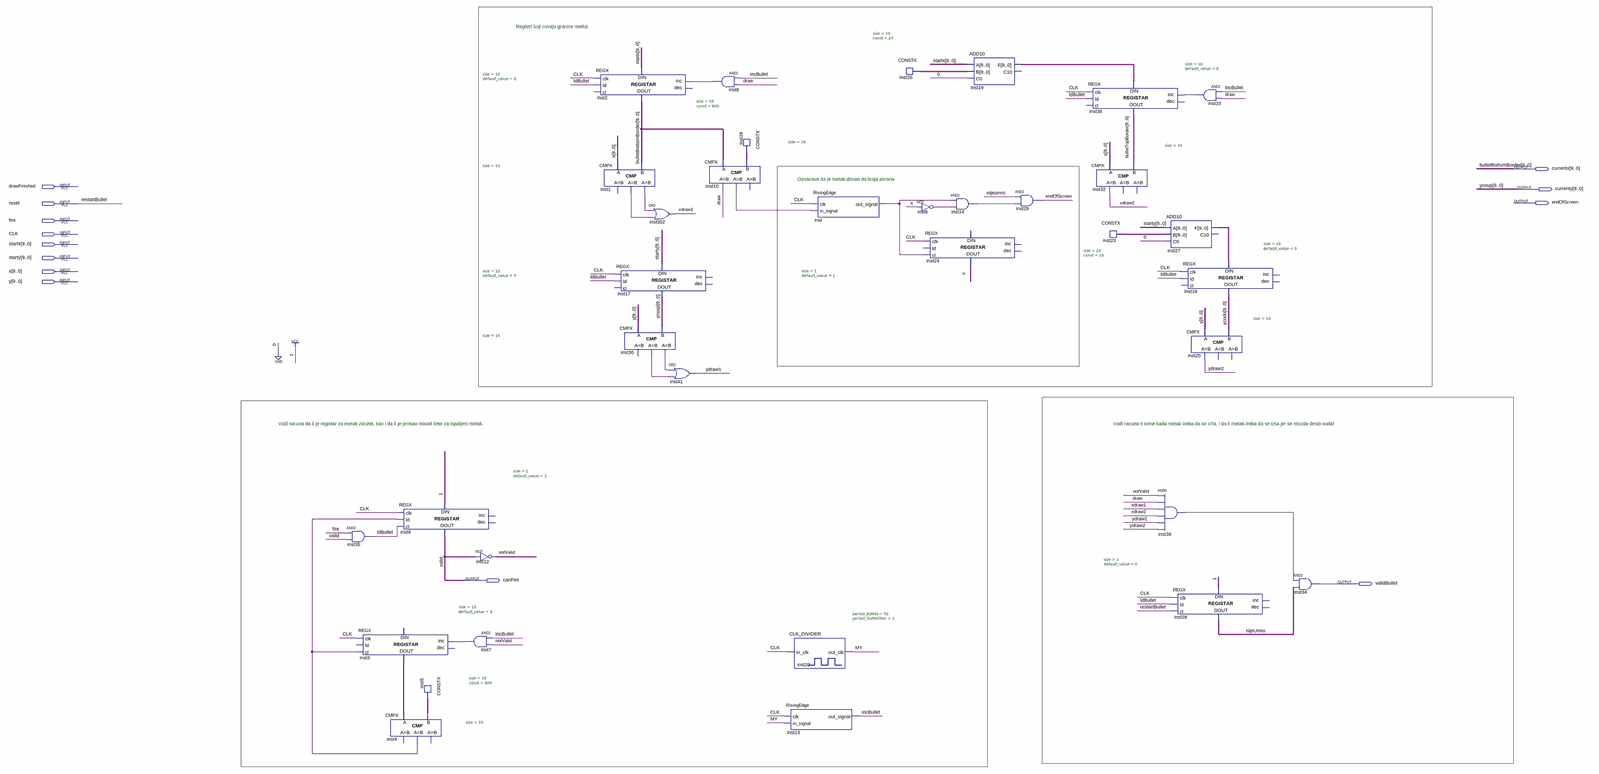
[diagram p0: schematic sheet, whole]
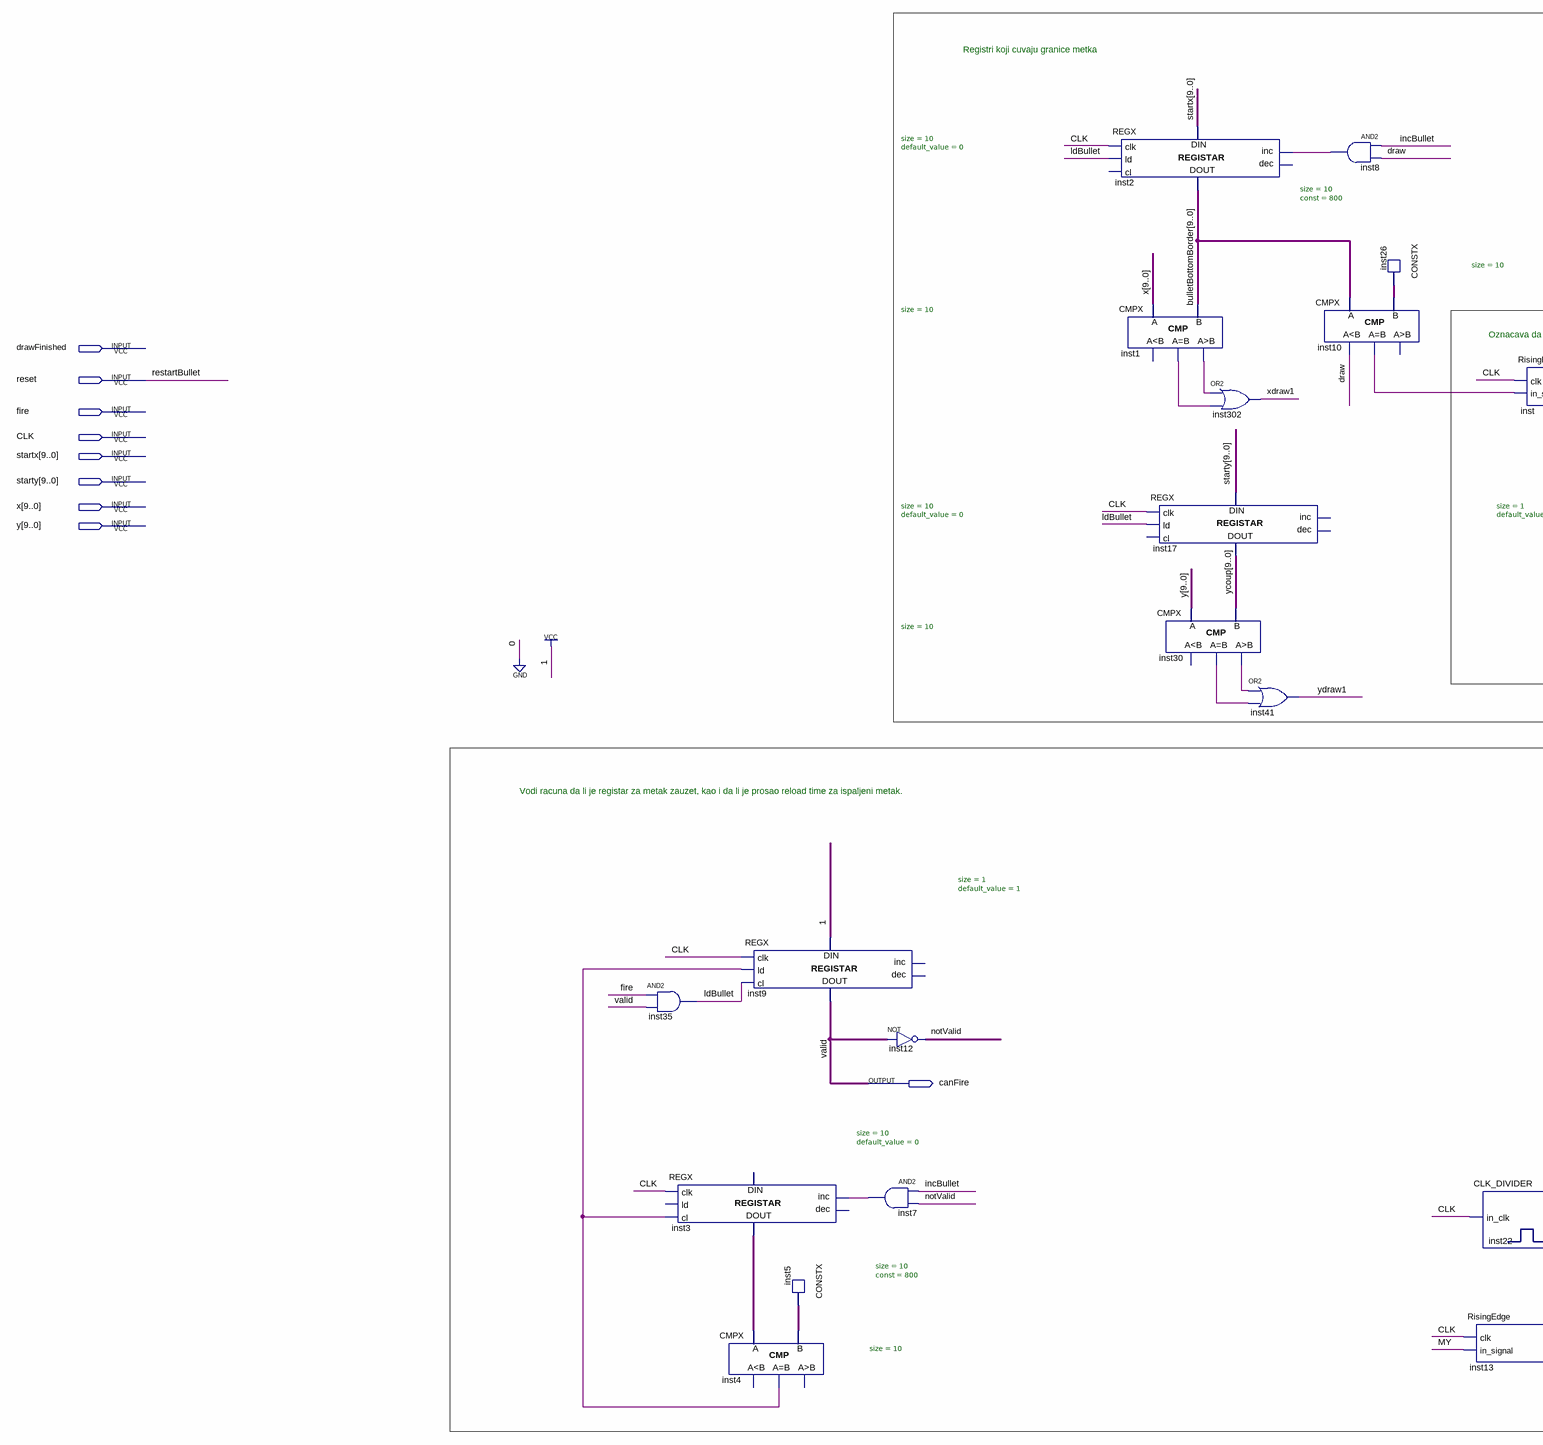
[diagram p1: schematic sheet, left part]
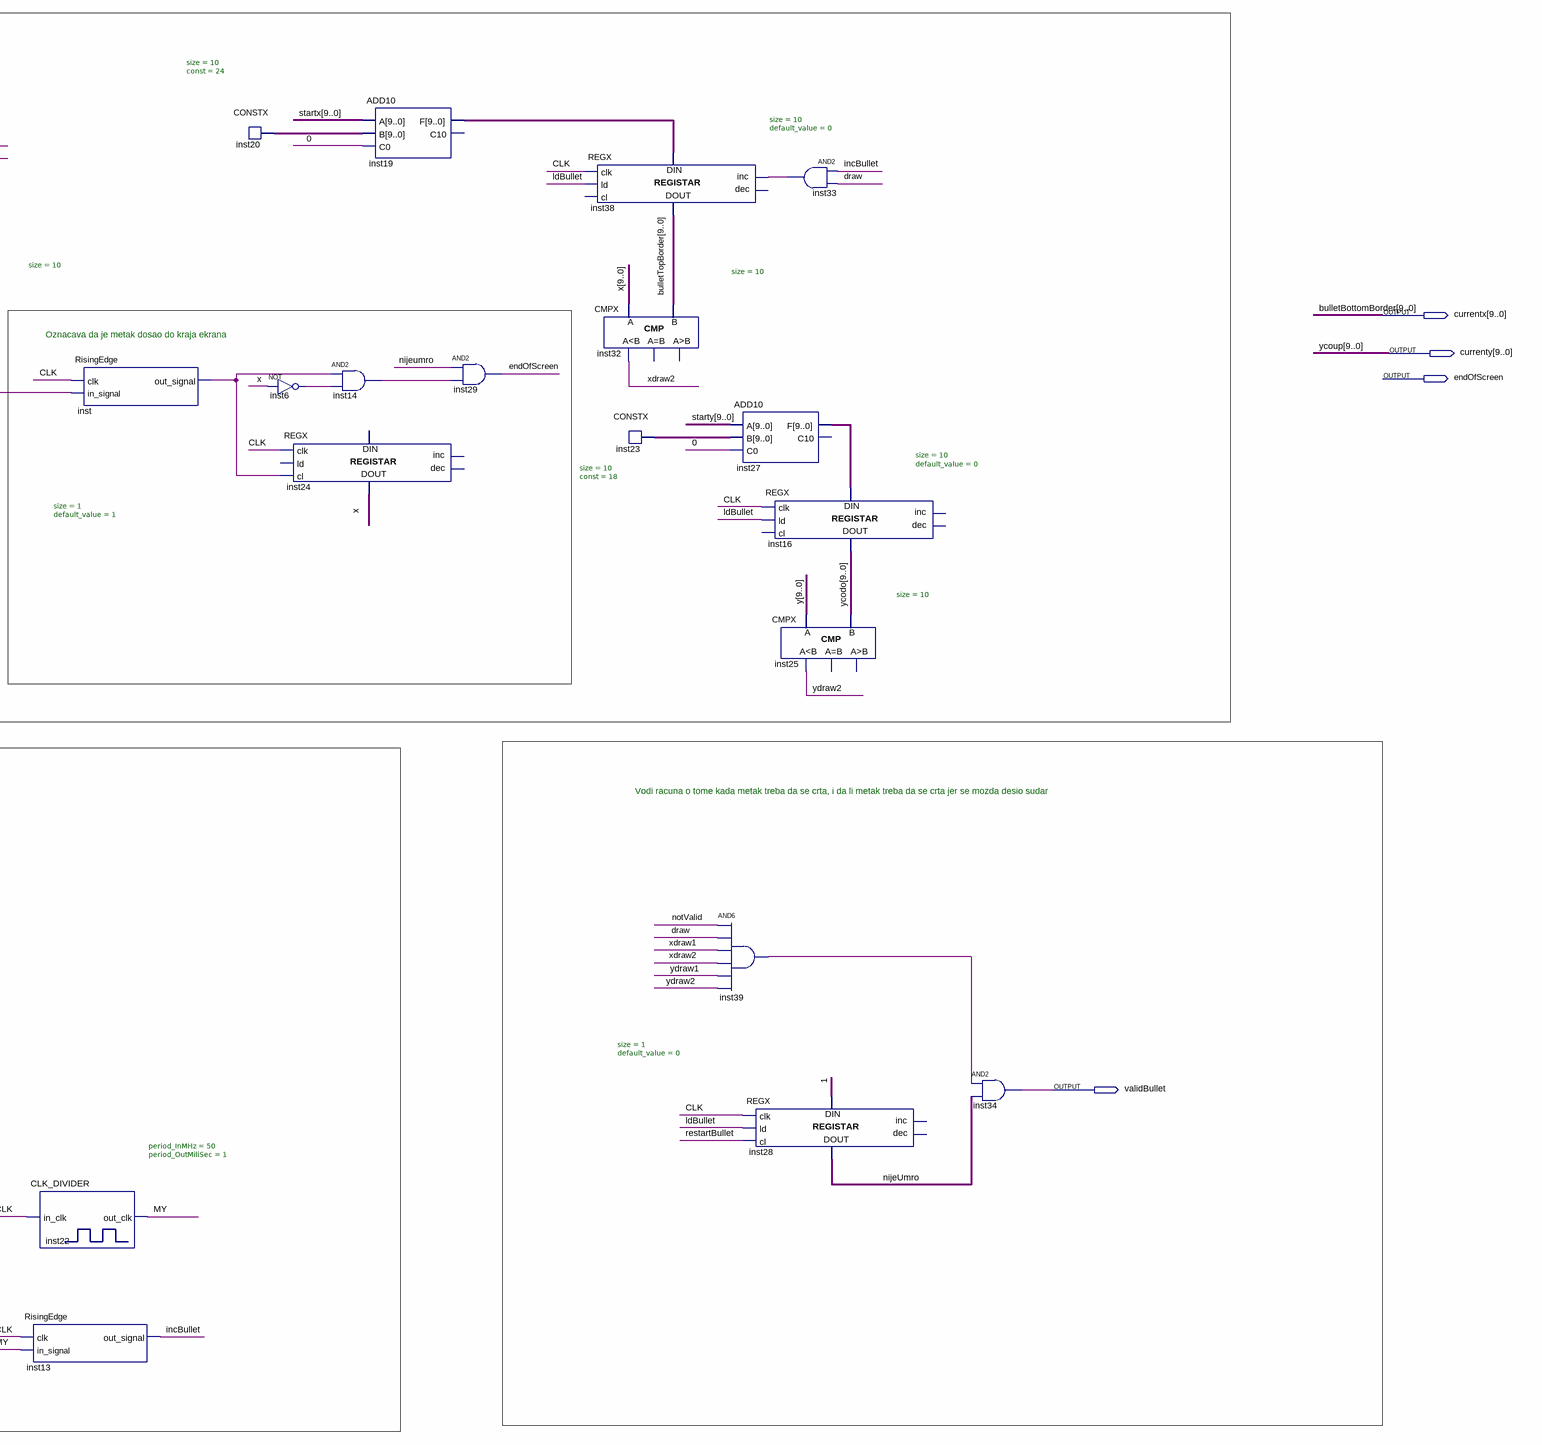
[diagram p2: schematic sheet, right part]
// Quartus schematic BulletGoodBoy.bdf as structural Verilog: 35 symbols, 13 pins
module BulletGoodBoy (
  input  drawFinished,
  input  reset,
  input  fire,
  input  CLK,
  input  [9:0] startx,
  input  [9:0] starty,
  input  [9:0] x,
  input  [9:0] y,
  output [9:0] currentx,
  output [9:0] currenty,
  output endOfScreen,
  output canFire,
  output validBullet
);

  wire draw, incBullet, inst1_eq, inst1_gr, inst4_eq, inst6_out, inst7_out, inst8_out, inst10_eq, inst14_out,
       inst30_eq, inst30_gr, inst33_out, inst39_out, inst_out_signal, ldBullet, MY, nijeUmro, notValid,
       x_1bit, xdraw1, xdraw2, ydraw1, ydraw2;
  wire [9:0] bulletTopBorder, inst3_data_out, inst5_data, inst19_f, inst20_data, inst23_data, inst26_data,
       inst27_f, ycodo;

  and inst35 (ldBullet, fire, canFire);
  REGX #(.size(10), .default_value(0)) inst3 (
    .clk(CLK), .cl(inst4_eq), .inc(inst7_out), .data_out(inst3_data_out));  // open: ld, dec, data_in
  CMPX #(.size(10)) inst4 (.A(inst3_data_out), .B(inst5_data), .eq(inst4_eq));  // open: ls, gr
  REGX #(.size(1), .default_value(1)) inst9 (
    .clk(CLK), .ld(inst4_eq), .cl(ldBullet), .data_in(1'b1), .data_out(canFire));  // open: inc, dec
  CONSTX #(.size(10), .\const (800)) inst5 (.data(inst5_data));
  not inst12 (notValid, canFire);
  and inst7 (inst7_out, incBullet, notValid);
  REGX #(.size(10), .default_value(0)) inst2 (
    .clk(CLK), .ld(ldBullet), .inc(inst8_out), .data_in(startx), .data_out(currentx));  // open: cl, dec
  CMPX #(.size(10)) inst1 (.A(x), .B(currentx), .eq(inst1_eq), .gr(inst1_gr));  // open: ls
  REGX #(.size(10), .default_value(0)) inst17 (
    .clk(CLK), .ld(ldBullet), .data_in(starty), .data_out(currenty));  // open: cl, inc, dec
  CMPX #(.size(10)) inst30 (.A(y), .B(currenty), .eq(inst30_eq), .gr(inst30_gr));  // open: ls
  or inst302 (xdraw1, inst1_gr, inst1_eq);
  or inst41 (ydraw1, inst30_gr, inst30_eq);
  and inst8 (inst8_out, incBullet, draw);
  CMPX #(.size(10)) inst10 (.A(currentx), .B(inst26_data), .ls(draw), .eq(inst10_eq));  // open: gr
  CONSTX #(.size(10), .\const (800)) inst26 (.data(inst26_data));
  CLK_DIVIDER #(.period_InMHz(50), .period_OutMiliSec(1)) inst22 (.in_clk(CLK), .out_clk(MY));
  RisingEdge inst13 (.clk(CLK), .in_signal(MY), .out_signal(incBullet));
  RisingEdge inst (.clk(CLK), .in_signal(inst10_eq), .out_signal(inst_out_signal));
  CONSTX #(.size(10), .\const (24)) inst20 (.data(inst20_data));
  not inst6 (inst6_out, x_1bit);
  REGX #(.size(1), .default_value(1)) inst24 (
    .clk(CLK), .cl(inst_out_signal), .data_out(x_1bit));  // open: ld, inc, dec, data_in
  and inst14 (inst14_out, inst_out_signal, inst6_out);
  ADD10 inst19 (.A(startx), .B(inst20_data), .C0(1'b0), .F(inst19_f));  // open: C10
  and inst29 (endOfScreen, nijeUmro, inst14_out);
  REGX #(.size(10), .default_value(0)) inst38 (
    .clk(CLK), .ld(ldBullet), .inc(inst33_out), .data_in(inst19_f), .data_out(bulletTopBorder));  // open: cl, dec
  CMPX #(.size(10)) inst32 (.A(x), .B(bulletTopBorder), .ls(xdraw2));  // open: eq, gr
  CONSTX #(.size(10), .\const (18)) inst23 (.data(inst23_data));
  ADD10 inst27 (.A(starty), .B(inst23_data), .C0(1'b0), .F(inst27_f));  // open: C10
  REGX #(.size(10), .default_value(0)) inst16 (
    .clk(CLK), .ld(ldBullet), .data_in(inst27_f), .data_out(ycodo));  // open: cl, inc, dec
  and inst39 (inst39_out, notValid, draw, xdraw1, xdraw2, ydraw1, ydraw2);
  REGX #(.size(1), .default_value(0)) inst28 (
    .clk(CLK), .ld(ldBullet), .cl(reset), .data_in(1'b1), .data_out(nijeUmro));  // open: inc, dec
  and inst33 (inst33_out, incBullet, draw);
  CMPX #(.size(10)) inst25 (.A(y), .B(ycodo), .ls(ydraw2));  // open: eq, gr
  and inst34 (validBullet, inst39_out, nijeUmro);

  // Other names for the same wires on the sheet: bulletBottomBorder[9:0] = currentx; restartBullet = reset;
  //   valid = canFire; ycoup[9:0] = currenty

  // Notes on the sheet:
  //   Registri koji cuvaju granice metka
  //   Oznacava da je metak dosao do kraja ekrana           
  //   Vodi racuna da li je registar za metak zauzet, kao i da li je prosao reload time za ispaljeni metak.
  //   Vodi racuna o tome kada metak treba da se crta, i da li metak treba da se crta jer se mozda desio sudar                      
endmodule
